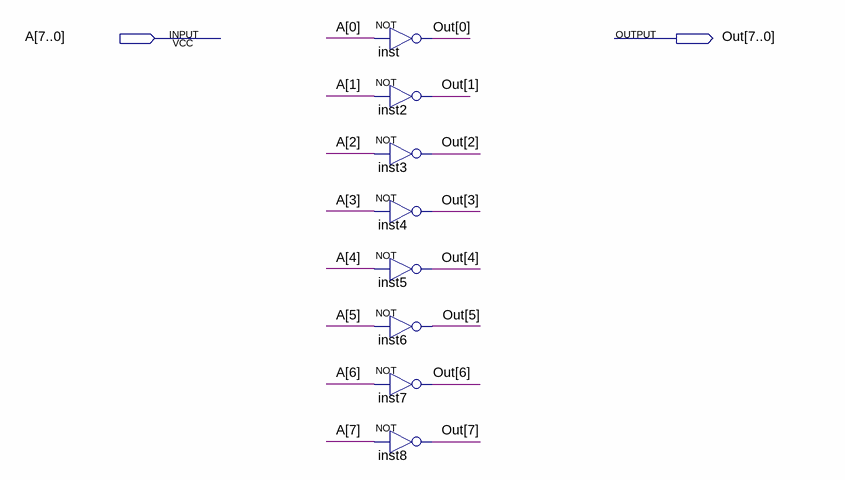
[diagram p0: schematic sheet]
// Quartus schematic Not_8bits.bdf as structural Verilog: 8 symbols, 2 pins
module Not_8bits (
  input  [7:0] A,
  output [7:0] Out
);

  not inst (Out[0], A[0]);
  not inst2 (Out[1], A[1]);
  not inst3 (Out[2], A[2]);
  not inst4 (Out[3], A[3]);
  not inst5 (Out[4], A[4]);
  not inst6 (Out[5], A[5]);
  not inst7 (Out[6], A[6]);
  not inst8 (Out[7], A[7]);
endmodule
